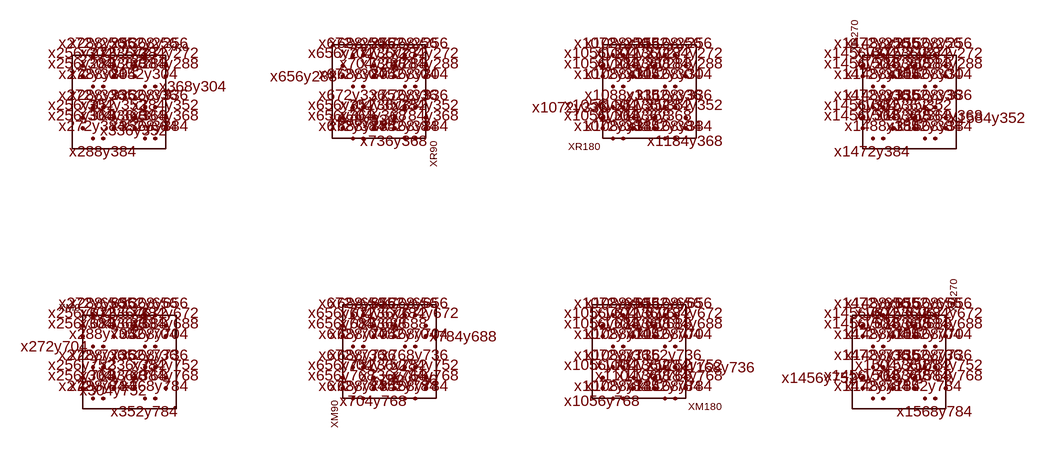
[diagram p0: schematic orientation_cell4.asc]
orientation_cell4.asc, the LTspice schematic file:
Version 4
SHEET 1 2000 1200
FLAG 288 304 x288y304
FLAG 288 336 x288y336
FLAG 304 288 x304y288
FLAG 304 352 x304y352
FLAG 336 288 x336y288
FLAG 336 352 x336y352
FLAG 352 304 x352y304
FLAG 352 336 x352y336
FLAG 272 304 x272y304
FLAG 272 336 x272y336
FLAG 304 272 x304y272
FLAG 304 368 x304y368
FLAG 336 272 x336y272
FLAG 336 368 x336y368
FLAG 368 304 x368y304
FLAG 368 336 x368y336
FLAG 256 288 x256y288
FLAG 256 352 x256y352
FLAG 288 256 x288y256
FLAG 288 384 x288y384
FLAG 352 256 x352y256
FLAG 352 384 x352y384
FLAG 384 288 x384y288
FLAG 384 352 x384y352
FLAG 256 272 x256y272
FLAG 256 368 x256y368
FLAG 272 256 x272y256
FLAG 272 384 x272y384
FLAG 368 256 x368y256
FLAG 368 384 x368y384
FLAG 384 272 x384y272
FLAG 384 368 x384y368
FLAG 688 304 x688y304
FLAG 688 336 x688y336
FLAG 704 288 x704y288
FLAG 704 352 x704y352
FLAG 736 288 x736y288
FLAG 736 352 x736y352
FLAG 752 304 x752y304
FLAG 752 336 x752y336
FLAG 672 304 x672y304
FLAG 672 336 x672y336
FLAG 704 272 x704y272
FLAG 704 368 x704y368
FLAG 736 272 x736y272
FLAG 736 368 x736y368
FLAG 768 304 x768y304
FLAG 768 336 x768y336
FLAG 656 288 x656y288
FLAG 656 352 x656y352
FLAG 688 256 x688y256
FLAG 688 384 x688y384
FLAG 752 256 x752y256
FLAG 752 384 x752y384
FLAG 784 288 x784y288
FLAG 784 352 x784y352
FLAG 656 272 x656y272
FLAG 656 368 x656y368
FLAG 672 256 x672y256
FLAG 672 384 x672y384
FLAG 768 256 x768y256
FLAG 768 384 x768y384
FLAG 784 272 x784y272
FLAG 784 368 x784y368
FLAG 1088 304 x1088y304
FLAG 1088 336 x1088y336
FLAG 1104 288 x1104y288
FLAG 1104 352 x1104y352
FLAG 1136 288 x1136y288
FLAG 1136 352 x1136y352
FLAG 1152 304 x1152y304
FLAG 1152 336 x1152y336
FLAG 1072 304 x1072y304
FLAG 1072 336 x1072y336
FLAG 1104 272 x1104y272
FLAG 1104 368 x1104y368
FLAG 1136 272 x1136y272
FLAG 1136 368 x1136y368
FLAG 1168 304 x1168y304
FLAG 1168 336 x1168y336
FLAG 1056 288 x1056y288
FLAG 1056 352 x1056y352
FLAG 1088 256 x1088y256
FLAG 1088 384 x1088y384
FLAG 1152 256 x1152y256
FLAG 1152 384 x1152y384
FLAG 1184 288 x1184y288
FLAG 1184 352 x1184y352
FLAG 1056 272 x1056y272
FLAG 1056 368 x1056y368
FLAG 1072 256 x1072y256
FLAG 1072 384 x1072y384
FLAG 1168 256 x1168y256
FLAG 1168 384 x1168y384
FLAG 1184 272 x1184y272
FLAG 1184 368 x1184y368
FLAG 1488 304 x1488y304
FLAG 1488 336 x1488y336
FLAG 1504 288 x1504y288
FLAG 1504 352 x1504y352
FLAG 1536 288 x1536y288
FLAG 1536 352 x1536y352
FLAG 1552 304 x1552y304
FLAG 1552 336 x1552y336
FLAG 1472 304 x1472y304
FLAG 1472 336 x1472y336
FLAG 1504 272 x1504y272
FLAG 1504 368 x1504y368
FLAG 1536 272 x1536y272
FLAG 1536 368 x1536y368
FLAG 1568 304 x1568y304
FLAG 1568 336 x1568y336
FLAG 1456 288 x1456y288
FLAG 1456 352 x1456y352
FLAG 1488 256 x1488y256
FLAG 1488 384 x1488y384
FLAG 1552 256 x1552y256
FLAG 1552 384 x1552y384
FLAG 1584 288 x1584y288
FLAG 1584 352 x1584y352
FLAG 1456 272 x1456y272
FLAG 1456 368 x1456y368
FLAG 1472 256 x1472y256
FLAG 1472 384 x1472y384
FLAG 1568 256 x1568y256
FLAG 1568 384 x1568y384
FLAG 1584 272 x1584y272
FLAG 1584 368 x1584y368
FLAG 288 704 x288y704
FLAG 288 736 x288y736
FLAG 304 688 x304y688
FLAG 304 752 x304y752
FLAG 336 688 x336y688
FLAG 336 752 x336y752
FLAG 352 704 x352y704
FLAG 352 736 x352y736
FLAG 272 704 x272y704
FLAG 272 736 x272y736
FLAG 304 672 x304y672
FLAG 304 768 x304y768
FLAG 336 672 x336y672
FLAG 336 768 x336y768
FLAG 368 704 x368y704
FLAG 368 736 x368y736
FLAG 256 688 x256y688
FLAG 256 752 x256y752
FLAG 288 656 x288y656
FLAG 288 784 x288y784
FLAG 352 656 x352y656
FLAG 352 784 x352y784
FLAG 384 688 x384y688
FLAG 384 752 x384y752
FLAG 256 672 x256y672
FLAG 256 768 x256y768
FLAG 272 656 x272y656
FLAG 272 784 x272y784
FLAG 368 656 x368y656
FLAG 368 784 x368y784
FLAG 384 672 x384y672
FLAG 384 768 x384y768
FLAG 688 704 x688y704
FLAG 688 736 x688y736
FLAG 704 688 x704y688
FLAG 704 752 x704y752
FLAG 736 688 x736y688
FLAG 736 752 x736y752
FLAG 752 704 x752y704
FLAG 752 736 x752y736
FLAG 672 704 x672y704
FLAG 672 736 x672y736
FLAG 704 672 x704y672
FLAG 704 768 x704y768
FLAG 736 672 x736y672
FLAG 736 768 x736y768
FLAG 768 704 x768y704
FLAG 768 736 x768y736
FLAG 656 688 x656y688
FLAG 656 752 x656y752
FLAG 688 656 x688y656
FLAG 688 784 x688y784
FLAG 752 656 x752y656
FLAG 752 784 x752y784
FLAG 784 688 x784y688
FLAG 784 752 x784y752
FLAG 656 672 x656y672
FLAG 656 768 x656y768
FLAG 672 656 x672y656
FLAG 672 784 x672y784
FLAG 768 656 x768y656
FLAG 768 784 x768y784
FLAG 784 672 x784y672
FLAG 784 768 x784y768
FLAG 1088 704 x1088y704
FLAG 1088 736 x1088y736
FLAG 1104 688 x1104y688
FLAG 1104 752 x1104y752
FLAG 1136 688 x1136y688
FLAG 1136 752 x1136y752
FLAG 1152 704 x1152y704
FLAG 1152 736 x1152y736
FLAG 1072 704 x1072y704
FLAG 1072 736 x1072y736
FLAG 1104 672 x1104y672
FLAG 1104 768 x1104y768
FLAG 1136 672 x1136y672
FLAG 1136 768 x1136y768
FLAG 1168 704 x1168y704
FLAG 1168 736 x1168y736
FLAG 1056 688 x1056y688
FLAG 1056 752 x1056y752
FLAG 1088 656 x1088y656
FLAG 1088 784 x1088y784
FLAG 1152 656 x1152y656
FLAG 1152 784 x1152y784
FLAG 1184 688 x1184y688
FLAG 1184 752 x1184y752
FLAG 1056 672 x1056y672
FLAG 1056 768 x1056y768
FLAG 1072 656 x1072y656
FLAG 1072 784 x1072y784
FLAG 1168 656 x1168y656
FLAG 1168 784 x1168y784
FLAG 1184 672 x1184y672
FLAG 1184 768 x1184y768
FLAG 1488 704 x1488y704
FLAG 1488 736 x1488y736
FLAG 1504 688 x1504y688
FLAG 1504 752 x1504y752
FLAG 1536 688 x1536y688
FLAG 1536 752 x1536y752
FLAG 1552 704 x1552y704
FLAG 1552 736 x1552y736
FLAG 1472 704 x1472y704
FLAG 1472 736 x1472y736
FLAG 1504 672 x1504y672
FLAG 1504 768 x1504y768
FLAG 1536 672 x1536y672
FLAG 1536 768 x1536y768
FLAG 1568 704 x1568y704
FLAG 1568 736 x1568y736
FLAG 1456 688 x1456y688
FLAG 1456 752 x1456y752
FLAG 1488 656 x1488y656
FLAG 1488 784 x1488y784
FLAG 1552 656 x1552y656
FLAG 1552 784 x1552y784
FLAG 1584 688 x1584y688
FLAG 1584 752 x1584y752
FLAG 1456 672 x1456y672
FLAG 1456 768 x1456y768
FLAG 1472 656 x1472y656
FLAG 1472 784 x1472y784
FLAG 1568 656 x1568y656
FLAG 1568 784 x1568y784
FLAG 1584 672 x1584y672
FLAG 1584 768 x1584y768
SYMBOL cell4 320 320 R0
SYMATTR InstName XR0
SYMBOL cell4 720 320 R90
SYMATTR InstName XR90
SYMBOL cell4 1120 320 R180
SYMATTR InstName XR180
SYMBOL cell4 1520 320 R270
SYMATTR InstName XR270
SYMBOL cell4 320 720 M0
SYMATTR InstName XM0
SYMBOL cell4 720 720 M90
SYMATTR InstName XM90
SYMBOL cell4 1120 720 M180
SYMATTR InstName XM180
SYMBOL cell4 1520 720 M270
SYMATTR InstName XM270

The netlist it stands for:
* orientation_cell4.asc
XXR0 x336y352 x368y304 x288y384 x256y272 cell4  ; pins a b c d
XXR90 x688y336 x736y368 x656y288 x768y256 cell4  ; pins a b c d
XXR180 x1104y288 x1072y336 x1152y256 x1184y368 cell4  ; pins a b c d
XXR270 x1552y304 x1504y272 x1584y352 x1472y384 cell4  ; pins a b c d
XXM0 x304y752 x272y704 x352y784 x384y672 cell4  ; pins a b c d
XXM90 x752y736 x704y768 x784y688 x672y656 cell4  ; pins a b c d
XXM180 x1136y688 x1168y736 x1088y656 x1056y768 cell4  ; pins a b c d
XXM270 x1488y704 x1536y672 x1456y752 x1568y784 cell4  ; pins a b c d
.backanno
.end